# Altium schematic sheet Audio.SchDoc
size 393 x 281 mm
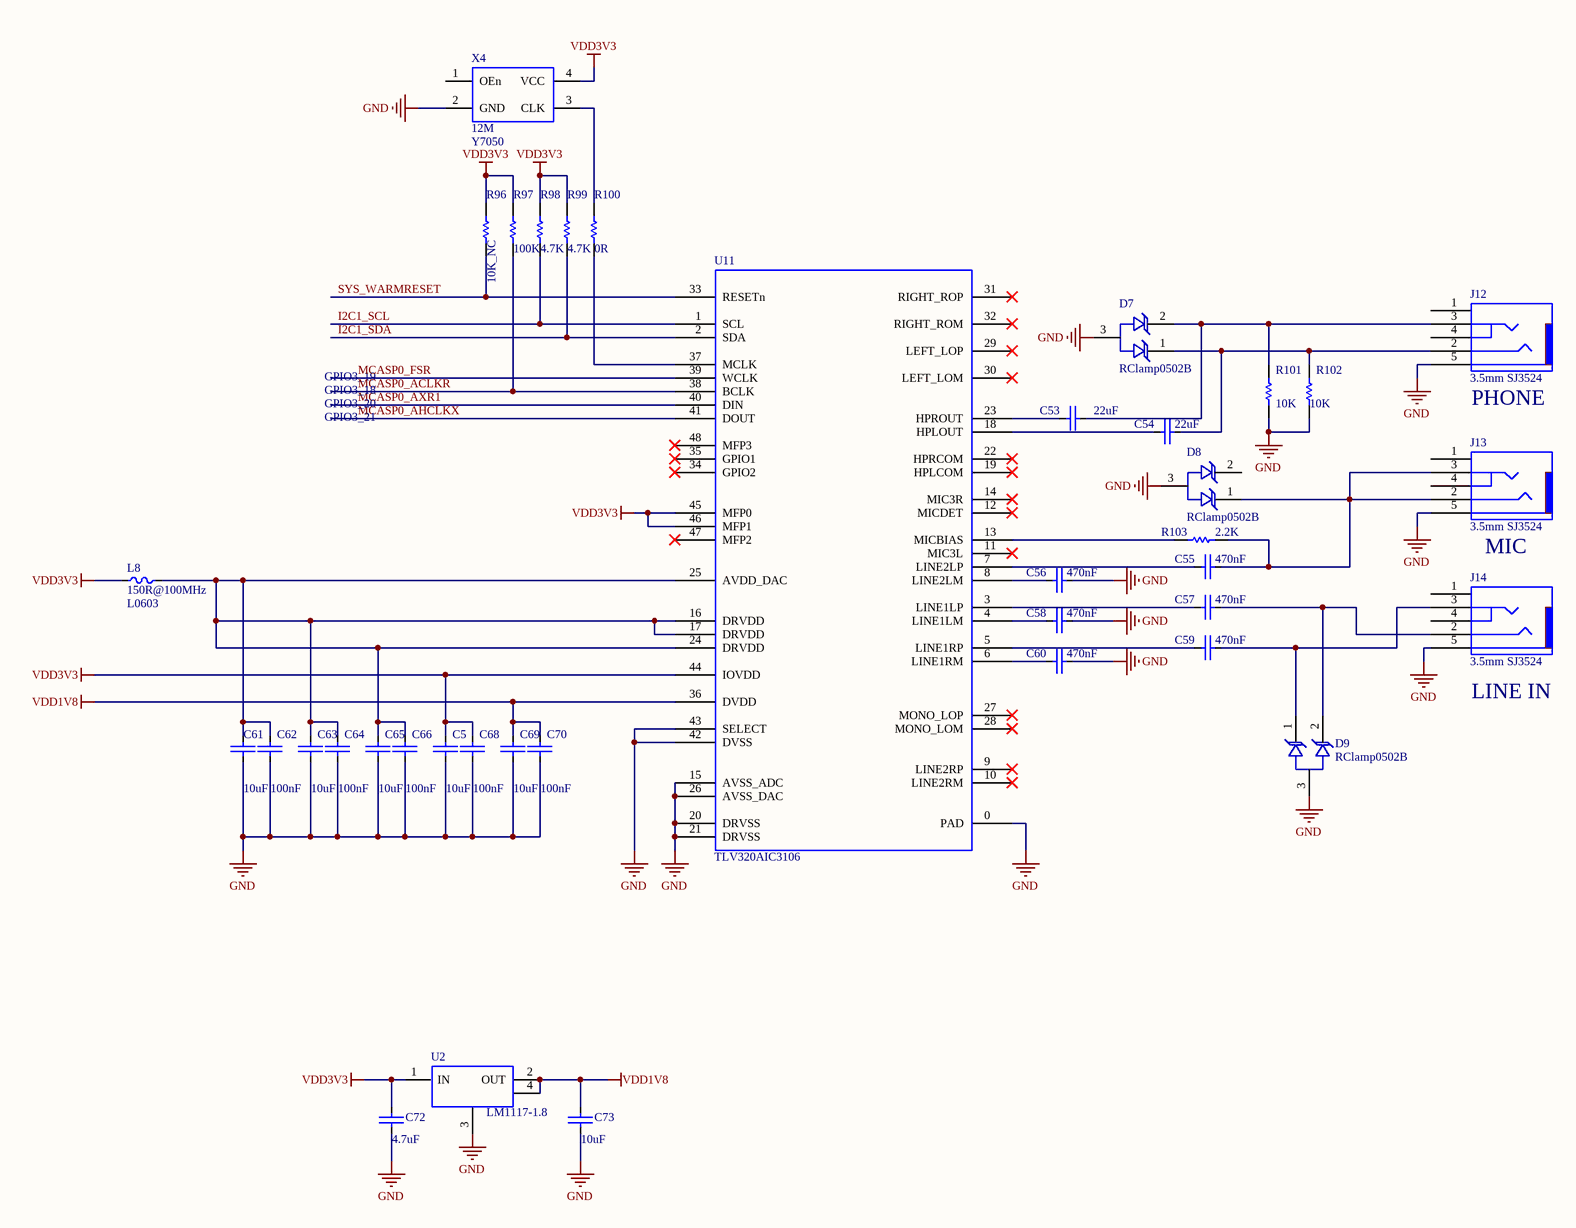
[diagram p0: Audio.SchDoc]

## Parts
C5  10uF  [C0603_M1608]
C53  22uF  [C1210_M3225]
C54  22uF  [C1210_M3225]
C55  470nF  [C0603_M1608]
C56  470nF  [C0603_M1608]
C57  470nF  [C0603_M1608]
C58  470nF  [C0603_M1608]
C59  470nF  [C0603_M1608]
C60  470nF  [C0603_M1608]
C61  10uF  [C0603_M1608]
C62  100nF  [C0603_M1608]
C63  10uF  [C0603_M1608]
C64  100nF  [C0603_M1608]
C65  10uF  [C0603_M1608]
C66  100nF  [C0603_M1608]
C68  100nF  [C0603_M1608]
C69  10uF  [C0603_M1608]
C70  100nF  [C0603_M1608]
C72  4.7uF  [C0603_M1608]
C73  10uF  [C0603_M1608]
D7  value RClamp0502B  [SOT-523]  (hidden comment: LCTVS)
D8  value RClamp0502B  [SOT-523]  (hidden comment: LCTVS)
D9  value RClamp0502B  [SOT-523]  (hidden comment: LCTVS)
J12  3.5mm SJ3524  [3.5mm SJ3524]
J13  3.5mm SJ3524  [3.5mm SJ3524]
J14  3.5mm SJ3524  [3.5mm SJ3524]
L8  150R@100MHz  value L0603  [L0603_M1608]
R96  10K_NC  [R0603_M1608]
R97  100K  [R0603_M1608]
R98  4.7K  [R0603_M1608]
R99  4.7K  [R0603_M1608]
R100  0R  [R0603_M1608]
R101  10K  [R0603_M1608]
R102  10K  [R0603_M1608]
R103  2.2K  [R0603_M1608]
U2  value LM1117-1.8  [LM1117]  (hidden comment: LM1117)
U11  TLV320AIC3106  [QFN48(TLV320)]
X4  12M  value Y7050  [Y7050]

## Nets
GND: C5.2 C56.2 C58.2 C60.2 C61.2 C62.2 C63.2 C64.2 C65.2 C66.2 C68.2 C69.2 C70.2 C72.2 C73.2 D7.3 D8.3 D9.3 J12.5 J13.5 J14.5 R101.1 R102.1 U2.3(GND) U11.0(PAD) U11.15(AVSS_ADC) U11.20(DRVSS) U11.21(DRVSS) U11.26(AVSS_DAC) U11.42(DVSS) U11.43(SELECT) X4.2(GND)
VDD1V8: C69.1 C70.1 C73.1 U2.2(OUT) U2.4 U11.36(DVDD)
VDD3V3: C5.1 C68.1 C72.1 L8.2 R96.2 R97.2 R98.2 R99.2 U2.1(IN) U11.44(IOVDD) U11.45(MFP0) U11.46(MFP1) X4.4(VCC)
I2C1_SCL: R98.1 U11.1(SCL)
I2C1_SDA: R99.1 U11.2(SDA)
MCASP0_ACLKR: R97.1 U11.38(BCLK)
MCASP0_AHCLKX: U11.41(DOUT)
MCASP0_AXR1: U11.40(DIN)
MCASP0_FSR: U11.39(WCLK)
SYS_WARMRESET: R96.1 U11.33(RESETn)
NetC53_1: C53.1 U11.23(HPROUT)
NetC53_2: C53.2 D7.2 J12.3 R101.2
NetC54_1: C54.1 U11.18(HPLOUT)
NetC54_2: C54.2 D7.1 J12.2 R102.2
NetC55_1: C55.1 U11.7(LINE2LP)
NetC55_2: C55.2 D8.1 J13.2 J13.3 R103.1
NetC56_1: C56.1 U11.8(LINE2LM)
NetC57_1: C57.1 U11.3(LINE1LP)
NetC57_2: C57.2 D9.2 J14.2
NetC58_1: C58.1 U11.4(LINE1LM)
NetC59_1: C59.1 U11.5(LINE1RP)
NetC59_2: C59.2 D9.1 J14.3
NetC60_1: C60.1 U11.6(LINE1RM)
NetC61_1: C61.1 C62.1 C63.1 C64.1 C65.1 C66.1 L8.1 U11.16(DRVDD) U11.17(DRVDD) U11.24(DRVDD) U11.25(AVDD_DAC)
NetR100_1: R100.1 U11.37(MCLK)
NetR100_2: R100.2 X4.3(CLK)
NetR103_2: R103.2 U11.13(MICBIAS)

Not connected (* = marked no-connect by the designer): D8 2; J12 1 4; J13 1 4; J14 1 4; U11 9(LINE2RP)* 10(LINE2RM)* 11(MIC3L)* 12(MICDET)* 14(MIC3R)* 19(HPLCOM)* 22(HPRCOM)* 27(MONO_LOP)* 28(MONO_LOM)* 29(LEFT_LOP)* 30(LEFT_LOM)* 31(RIGHT_ROP)* 32(RIGHT_ROM)* 34(GPIO2)* 35(GPIO1)* 47(MFP2)* 48(MFP3)*; X4 1(OEn)

## Notes on the sheet
- GPIO3_21
- GPIO3_20
- GPIO3_19
- GPIO3_18
- (near J12) PHONE
- MIC
- (near J14) LINE IN
- 设计
- 标准化
- 审核
- 批  准
- 版本
- 工艺
- 日  期
- 第    页
- 共    页

## Library data of the parts
C5 C53-C66 C68-C70 C72 C73 = CAP_1: value: C0805
L8 = BEADS: 0603
R96-R103 = Res1: R0603; Published: 8-Jun-2000; LatestRevisionDate: 17-Jul-2002; LatestRevisionNote: Re-released for DXP Platform.; PackageReference: AXIAL-0.3; Publisher: Altium Limited; PackageDescription: Axial Device, Thru-Hole; 2 Leads; 0.3 in Pin Spacing; Value: R0603
U11 = TLV320AIC3106: AUDIO ENCODE
X4 = 12M XTAL